# EAGLE design ATtiny841_StepperTesting (EAGLE 7.4.0)
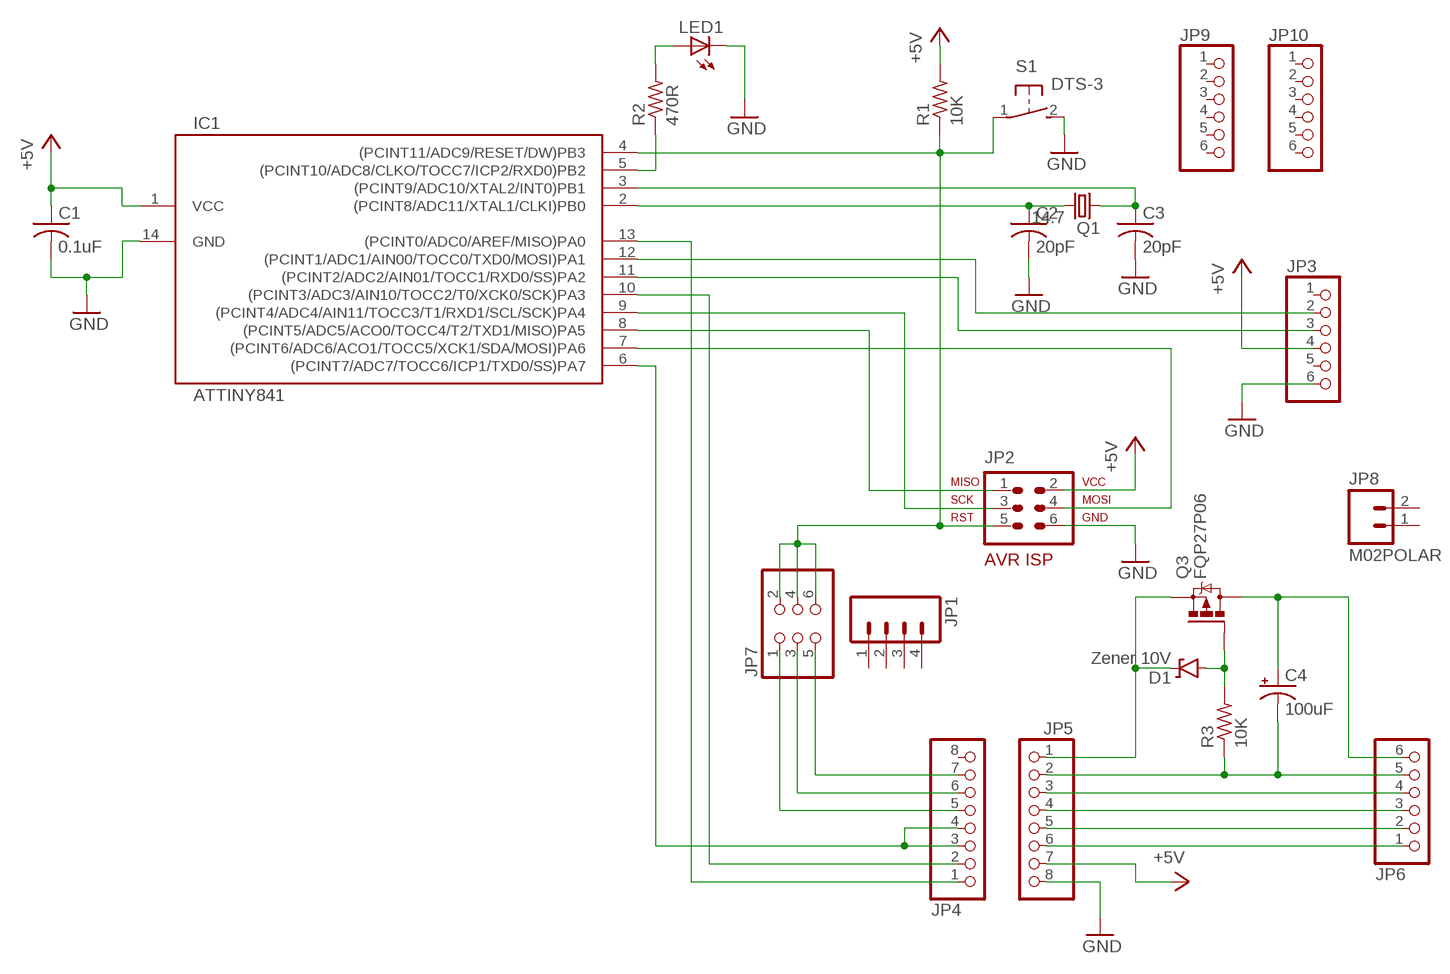
[diagram p0: schematic, sheet 1]

## Parts
C1  0.1uF  C025  [C025-024X044]
C2  20pF  C025  [C025-024X044]
C3  20pF  C025  [C025-024X044]
C4  100uF  CPOL-USE3.5-8  [E3,5-8]
D1  Zener 10V  DIODE-ZENERPTH  [DIODE-ZENER]
IC1  ATTINY841  ATTINY441/841-SSU  [SOIC14]
JP1  M04POLAR  [MOLEX-1X4]
JP2  AVR-ISP-6VERT  [AVR-ISP-6]
JP3  PINHD-1X6CB  [1X06-CLEANBIG]
JP4  PINHD-1X8CLEANBIG  [1X08-CLEANBIG]
JP5  PINHD-1X8CLEANBIG  [1X08-CLEANBIG]
JP6  PINHD-1X6CB  [1X06-CLEANBIG]
JP7  PINHD-2X3  [2X03]
JP8  M02POLAR  [MOLEX-1X2]
JP9  PINHD-1X6CB  [1X06-CLEANBIG]
JP10  PINHD-1X6CB  [1X06-CLEANBIG]
LED1  LED5MM  [LED5MM]
Q1  14.7  CRYSTALHC49S  [HC49/S]
Q3  FQP27P06  IRF9530  [TO220BV]
R1  10K  R-US_0207/7  [0207/7]
R2  470R  R-US_0207/7  [0207/7]
R3  10K  R-US_0207/7  [0207/7]
S1  DTS-3  [DTS-3]

## Nets
+5V: C1.1 IC1.1(VCC) JP2.2 JP3.4 JP5.7 R1.2
DIR: IC1.13((PCINT0/ADC0/AREF/MISO)PA0) JP4.1
GND: C1.2 C2.2 C3.2 IC1.14(GND) JP2.6 JP3.6 JP5.8 LED1.K(C) S1.2
MISO: IC1.8((PCINT5/ADC5/ACO0/TOCC4/T2/TXD1/MISO)PA5) JP2.1
MM-IN: C4.+ JP6.6 Q3.D
MOSI: IC1.7((PCINT6/ADC6/ACO1/TOCC5/XCK1/SDA/MOSI)PA6) JP2.4
MOT-RET: C4.- JP5.2 JP6.5 R3.1
MS1: JP4.7 JP7.5
MS2: JP4.6 JP7.3
MS3: JP4.5 JP7.1
N$9: JP5.3 JP6.4
N$11: LED1.A R2.2
N$12: JP5.4 JP6.3
N$13: JP5.5 JP6.2
N$14: JP5.6 JP6.1
N$17: D1.P$2(A) Q3.G R3.2
PB2: IC1.5((PCINT10/ADC8/CLKO/TOCC7/ICP2/RXD0)PB2) R2.1
RST: IC1.4((PCINT11/ADC9/RESET/DW)PB3) JP2.5 JP7.2 JP7.4 JP7.6 R1.1 S1.1
RXD0: IC1.11((PCINT2/ADC2/AIN01/TOCC1/RXD0/SS)PA2) JP3.3
SCK: IC1.9((PCINT4/ADC4/AIN11/TOCC3/T1/RXD1/SCL/SCK)PA4) JP2.3
SLEEP: IC1.6((PCINT7/ADC7/TOCC6/ICP1/TXD0/SS)PA7) JP4.3 JP4.4
STEP: IC1.10((PCINT3/ADC3/AIN10/TOCC2/T0/XCK0/SCK)PA3) JP4.2
TXD0: IC1.12((PCINT1/ADC1/AIN00/TOCC0/TXD0/MOSI)PA1) JP3.2
VMOT: D1.P$1(C) JP5.1 Q3.S
XTAL1: C3.1 IC1.3((PCINT9/ADC10/XTAL2/INT0)PB1) Q1.1
XTAL2: C2.1 IC1.2((PCINT8/ADC11/XTAL1/CLKI)PB0) Q1.2
Unconnected: JP1.1 JP1.2 JP1.3 JP1.4 JP3.1 JP3.5 JP4.8 JP8.1 JP8.2 JP9.1 JP9.2 JP9.3 JP9.4 JP9.5 JP9.6 JP10.1 JP10.2 JP10.3 JP10.4 JP10.5 JP10.6

## Library data of the parts
C1-C3 = au:C025
C4 = rcl:CPOL-US: POLARIZED CAPACITOR, American symbol
D1 = au:DIODE-ZENER: Zener Diode Production Part - 8199 3.4V Zener Voltage
IC1 = bog-thoughts_AVR:ATTINY441/841: ATtiny441, ATtiny841 AVR Microcontroller The high-performance Atmel picoPower 8-bit AVR RISC-based microcontroller combines 4KB ISP flash memory, 512-Byte EEPROM, 128B SRAM, 12 general purpose I/O lines, 32 general purpose working registers, an 8-bit timer/counter with two PWM channels, two 16-bit timer/counters with two PWM channels, internal and external interrupts, an 12-channel 10-bit A/D converter, 2 On-chip analog comparators, 2 full duplex USARTs with Start Frame wake up from power down, master/slave SPI serial interface, slave I2C serial interface, programmable gain stage (1x, 20x, and 100x) for 12 differential ADC channel pairs, programmable watchdog timer with internal oscillator, internal calibrated oscillator, and four software selectable power saving modes. The device operates between 1.7-5.5 volts. datasheet.pdf <http://www.atmel.com/Images/Atmel-8495-8-bit-AVR-Microcontrollers-ATtiny441-ATtiny841_Datasheet.pdf>
JP1 = SparkFun-Connectors:M04: Header 4 Standard 4-pin 0.1" header. Use with straight break away headers (SKU : PRT-00116), right angle break away headers (PRT-00553), swiss pins (PRT-00743), machine pins (PRT-00117), and female headers (PRT-00115). Molex polarized connector foot print use with SKU : PRT-08231 with associated crimp pins and housings. 1MM SMD Version SKU: PRT-10208
JP2 = avr-7:AVR-ISP-6: AVR ISP-6 Serial Programming Header
JP3 JP6 JP9 JP10 = adafruit:PINHD-1X6: PIN HEADER
JP4 JP5 = adafruit:PINHD-1X8: PIN HEADER
JP7 = SparkFun-Connectors:PINHD-2X3: PIN HEADER
JP8 = SparkFun-Connectors:M02: Standard 2-pin 0.1" header. Use with - straight break away headers ( PRT-00116) - right angle break away headers (PRT-00553) - swiss pins (PRT-00743) - machine pins (PRT-00117) - female headers (PRT-00115) Molex polarized connector foot print use with: PRT-08233 with associated crimp pins and housings. 2.54_SCREWTERM for use with PRT-10571. 3.5mm Screw Terminal footprints for PRT-08084 5mm Screw Terminal footprints for use with PRT-08432
LED1 = adafruit:LED: LED OSRAM: - CHIPLED LG R971, LG N971, LY N971, LG Q971, LY Q971, LO R971, LY R971 LH N974, LH R974 LS Q976, LO Q976, LY Q976 LO Q996 - Hyper CHIPLED LW Q18S LB Q993, LB Q99A, LB R99A - SideLED LS A670, LO A670, LY A670, LG A670, LP A670 LB A673, LV A673, LT A673, LW A673 LH A674 LY A675 LS A676, LA A676, LO A676, LY A676, LW A676 LS A679, LY A679, LG A679 - Hyper Micro SIDELED® LS Y876, LA Y876, LO Y876, LY Y876 LT Y87S - SmartLED LW L88C, LW L88S LB L89C, LB L89S, LG L890 LS L89K, LO L89K, LY L89K LS L896, LA L896, LO L896, LY L896 - TOPLED LS T670, LO T670, LY T670, LG T670, LP T670 LSG T670, LSP T670, LSY T670, LOP T670, LYG T670 LG T671, LOG T671, LSG T671 LB T673, LV T673, LT T673, LW T673 LH T674 LS T676, LA T676, LO T676, LY T676, LB T676, LH T676, LSB T676, LW T676 LB T67C, LV T67C, LT T67C, LS T67K, LO T67K, LY T67K, LW E67C LS E67B, LA E67B, LO E67B, LY E67B, LB E67C, LV E67C, LT E67C LW T67C LS T679, LY T679, LG T679 LS T770, LO T770, LY T770, LG T770, LP T770 LB T773, LV T773, LT T773, LW T773 LH T774 LS E675, LA E675, LY E675, LS T675 LS T776, LA T776, LO T776, LY T776, LB T776 LHGB T686 LT T68C, LB T68C - Hyper Mini TOPLED® LB M676 - Mini TOPLED Santana® LG M470 LS M47K, LO M47K, LY M47K Source: http://www.osram.convergy.de/
Q1 = crystal:CRYSTAL: CRYSTAL; OC_FARNELL: 1667008; OC_NEWARK: unknown
Q3 = transistor-power:IRF9530: P-CHANNEL HEXFET POWER-MOS-FET Source: http://www.irf.com/product-info/datasheets/data/irf9530.pdf
R1-R3 = adafruit:R-US_: RESISTOR, American symbol
S1 = au:DTS-3

## Board
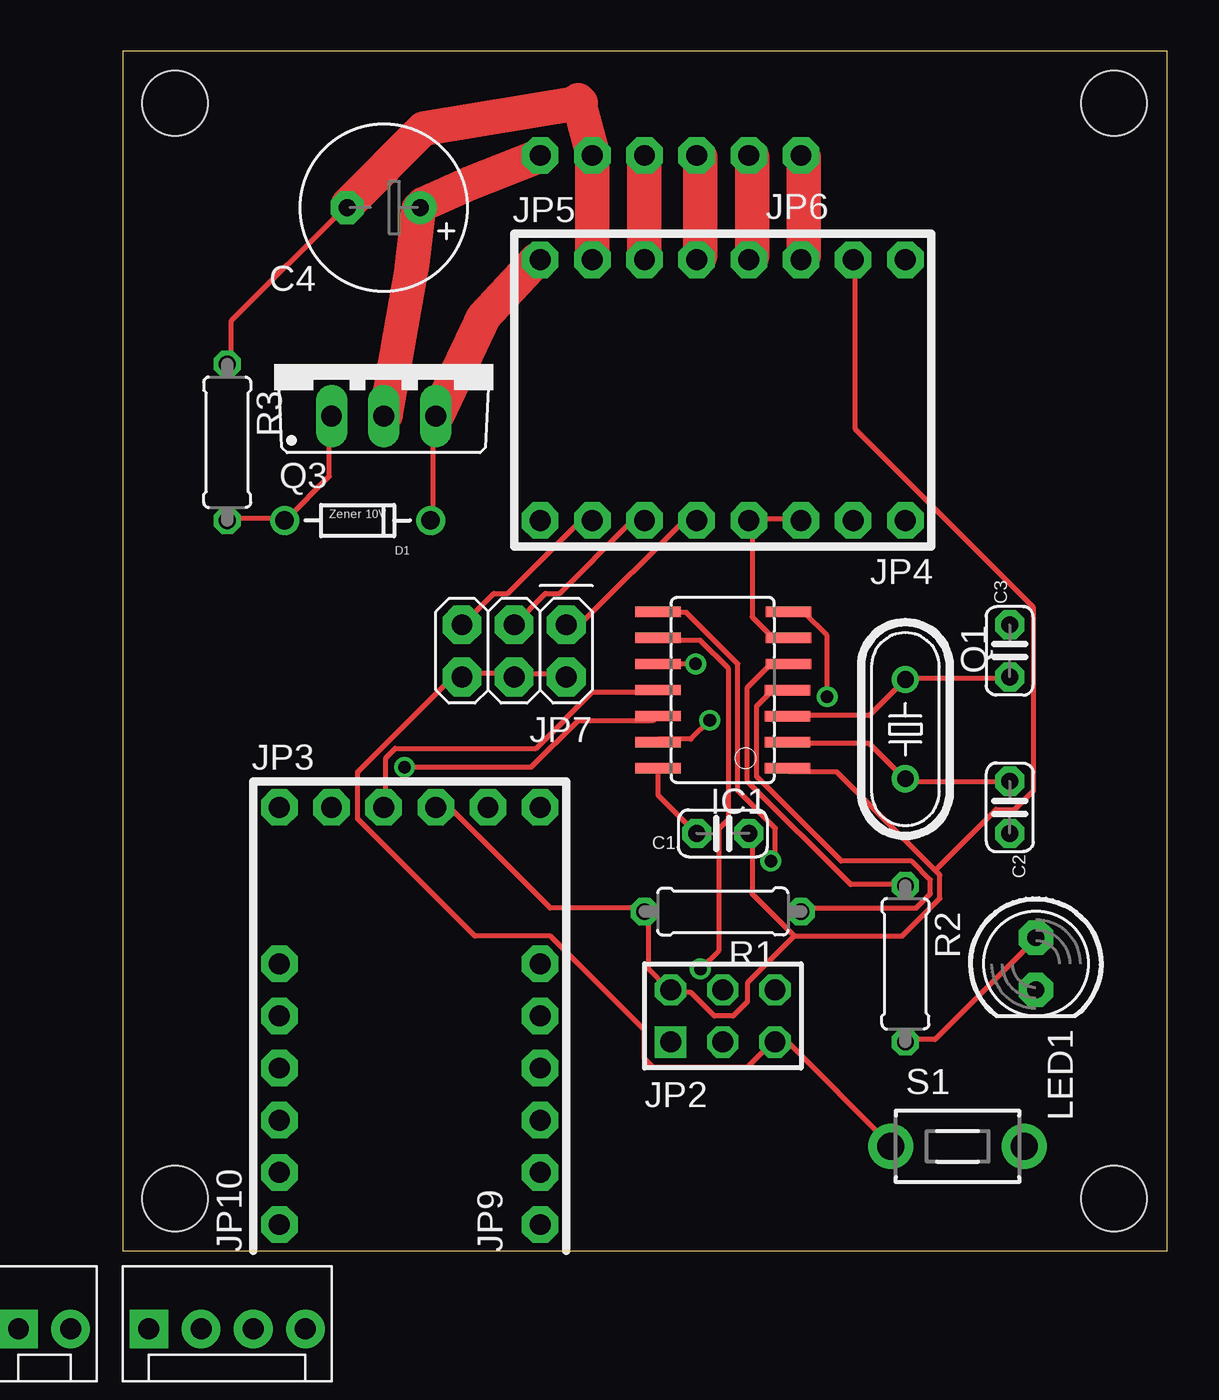
[diagram p1: board, top side]
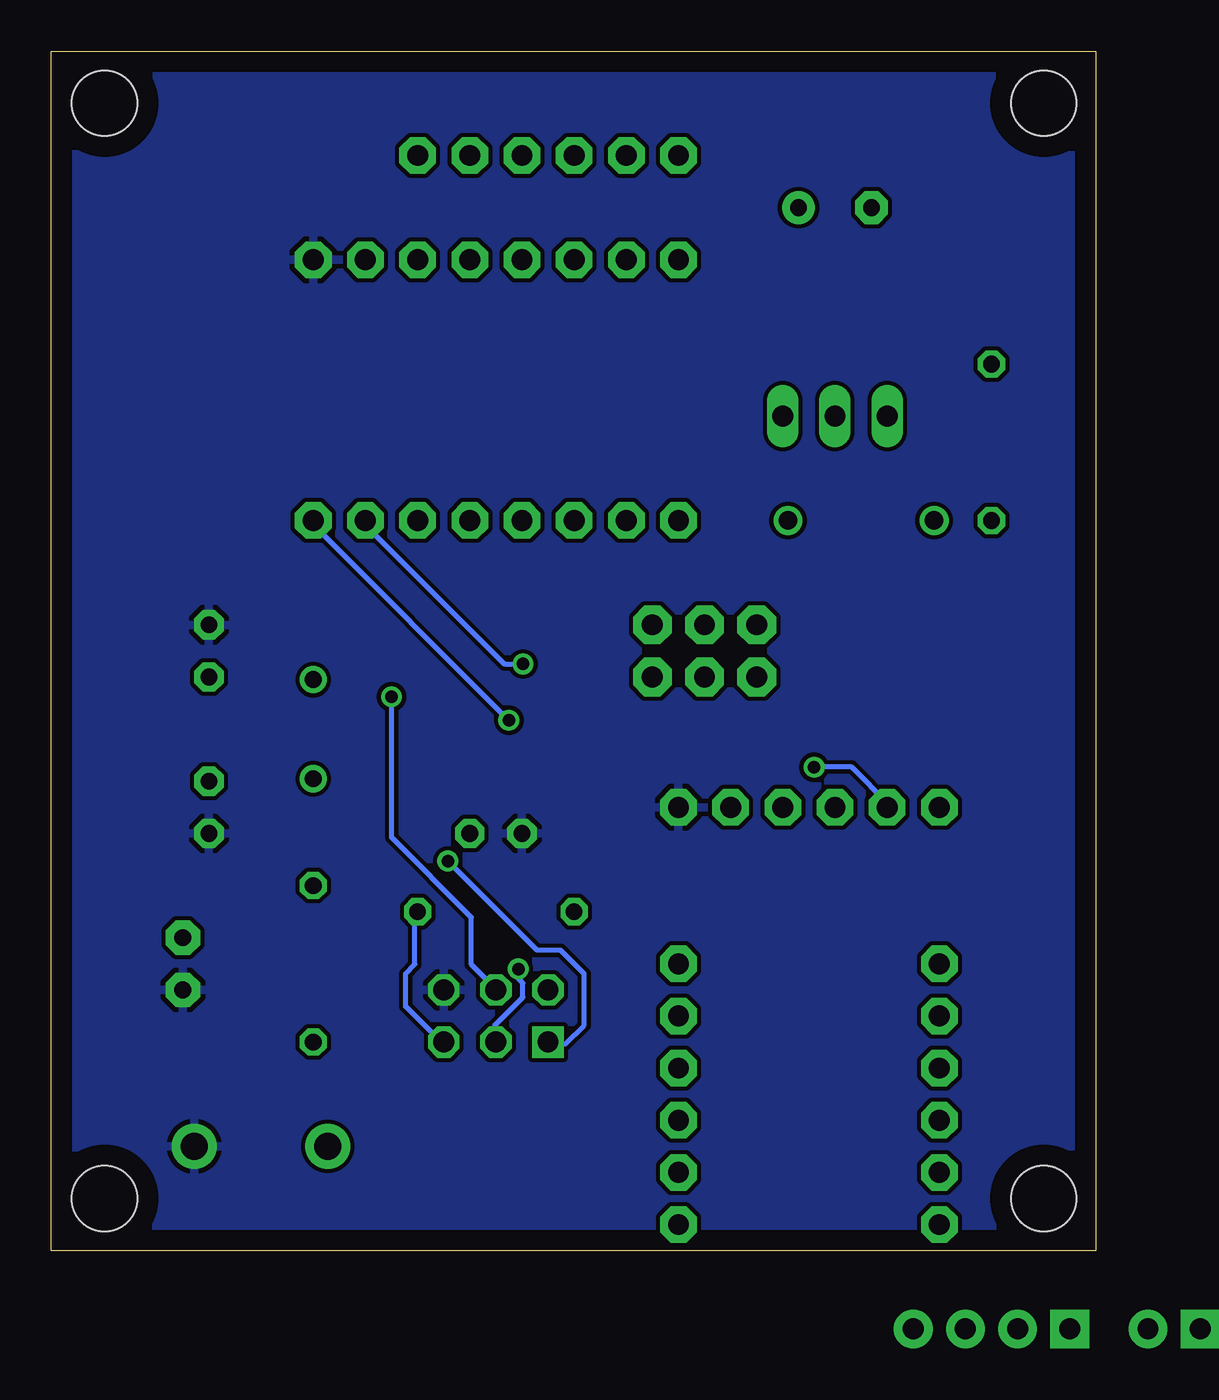
[diagram p2: board, bottom side, seen from below]

Size 50.85 x 58.41 mm. Coordinates in mm from the lower left corner, seen from the top.
Outline: 0,0 50.85,0 50.85,58.41 0,58.41 0,0
Copper layers (1*16): Top 0.035mm / dielectric 1.5mm / Bottom 0.035mm
Design rules "default *": minimum track width 10mil, minimum drill 24mil, track to track 8mil, track to pad 10mil, pad to pad 8mil, via to via 8mil, smd to smd 8mil, copper to edge 40mil, drill to drill 8mil, minimum pad ring 10mil, minimum via ring 8mil, stop-mask expansion 4mil, vias tented up to drill 0mil, thermal gap 10mil
Holes 3.17 mm at 2.54,2.54 2.54,55.88 48.26,2.54 48.26,55.88

### Footprints (pad centres in the part's own frame; a part is rotated, then mirrored left to right if it is on the bottom)
C025-024X044 = drill 0.813 pad 1.422 octagon: 1 -1.27,0; 2 1.27,0
E3,5-8 = drill 0.813 pad 1.6: + -1.778,0 | drill 0.813 pad 1.6 octagon: - 1.778,0
DIODE-ZENER = drill 0.9: P$1 -3.556,0; P$2 3.556,0
SOIC14 = smd 0.5 x 2.2: 1 -1.905,-3.154; 2 -0.645,-3.154; 3 0.625,-3.154; 4 1.895,-3.154; 5 3.175,-3.196; 6 4.445,-3.196; 7 5.715,-3.196; 8 5.715,3.154; 9 4.445,3.154; 10 3.175,3.154; 11 1.905,3.154; 12 0.635,3.154; 13 -0.635,3.154; 14 -1.905,3.154
MOLEX-1X4 = drill 1.016 pad 1.88 square: 1 0,0 | drill 1.016 pad 1.88: 2 2.54,0; 3 5.08,0; 4 7.62,0
AVR-ISP-6 = drill 1.016 square: 1 -2.54,-1.27 | drill 1.016 octagon: 2 -2.54,1.27; 3 0,-1.27; 4 0,1.27; 5 2.54,-1.27; 6 2.54,1.27
1X06-CLEANBIG = drill 1.016 pad 1.778 octagon: 1 -6.35,0; 2 -3.81,0; 3 -1.27,0; 4 1.27,0; 5 3.81,0; 6 6.35,0
1X08-CLEANBIG = drill 1.016 pad 1.778 octagon: 1 -8.89,0; 2 -6.35,0; 3 -3.81,0; 4 -1.27,0; 5 1.27,0; 6 3.81,0; 7 6.35,0; 8 8.89,0
2X03 = drill 1.016 pad 1.88 octagon: 1 -2.54,-1.27; 2 -2.54,1.27; 3 0,-1.27; 4 0,1.27; 5 2.54,-1.27; 6 2.54,1.27
MOLEX-1X2 = drill 1.016 pad 1.88 square: 1 0,0 | drill 1.016 pad 1.88: 2 2.54,0
LED5MM = drill 0.813 pad 1.676 octagon: A -1.27,0; K 1.27,0
HC49/S = drill 0.813: 1 -2.413,0; 2 2.413,0
TO220BV = drill 1.016 long: D 0,-2.54; G -2.54,-2.54; S 2.54,-2.54
0207/7 = drill 0.813 octagon: 1 -3.81,0; 2 3.81,0
DTS-3 = drill 1.3 pad 2.184: 1 -3.25,0; 2 3.25,0

### Placement (x,y rotation side)
C1  29.21,20.32 180 top
C2  43.18,21.59 270 top
C3  43.18,29.21 90 top
C4  12.7,50.8 180 top
D1  11.43,35.56 180 top
IC1  29.21,25.4 90 top
JP1  1.27,-3.81 0 top  (outside the outline)
JP2  29.21,11.43 0 top
JP3  13.97,21.59 0 top
JP4  29.21,35.56 180 top
JP5  29.21,48.26 0 top
JP6  26.67,53.34 180 top
JP7  19.05,29.21 180 top
JP8  -5.08,-3.81 0 top  (outside the outline)
JP9  20.32,7.62 90 top
JP10  7.62,7.62 90 top
LED1  44.45,13.97 270 top
Q1  38.1,25.4 270 top
Q3  12.7,43.18 0 top
R1  29.21,16.51 180 top
R2  38.1,13.97 270 top
R3  5.08,39.37 270 top
S1  40.64,5.08 0 top

### Tracks (layer width: path | path; a pad name or v marks a point on that pad's centre or on a via)
+5V
  Top 0.254: JP3.4 15.32,21.49 16,21.49 20.8,16.69 25.38,16.69 R1.2 25.6,16.46 25.6,13.72 26.52,12.8 JP2.2 26.75,12.57 27.66,12.57 28.8,11.43 29.72,11.43 30.4,12.12 30.4,13.03 32.69,15.32 | 39.55,18.52 39.78,18.29 39.78,17.14 37.95,15.32 32.69,15.32 | 39.55,18.52 34.75,23.32 32.46,23.32 IC1.1 | 32.69,15.32 30.63,17.37 30.63,20.12 C1.1 | 39.55,18.52 42.52,21.49 43.43,21.49 44.35,22.4 44.35,31.32 35.66,40.01 35.66,48.23 JP5.7
DIR  (via drill 0.61)
  Top 0.254: v28.57,25.83 27.66,24.92 26.06,24.92 IC1.13
  Bottom 0.254: v28.57,25.83 38.18,35.43 JP4.1
GND
  Top 0.254: IC1.14 26.06,23.32 26.06,22.17 27.89,20.34 C1.2
  pour Bottom: 0,0 50.8,0 50.8,58.42 0,58.42
MISO  (via drill 0.61)
  Top 0.254: v31.55,18.97 31.77,19.2 31.77,20.57 29.95,22.4 29.95,28.57 27.43,31.09 26.06,31.09 IC1.8
  Bottom 0.254: v31.55,18.97 27.2,14.63 26.06,14.63 24.92,13.49 24.92,10.97 25.83,10.06 26.52,10.06 JP2.1
MM-IN
  Top 0.254: 12.8,40.69 Q3.D | 14.4,50.75 C4.+ 14.63,50.98 | 20.12,53.26 JP6.6
  Top 1.676: 12.8,40.69 14.07,47.88 14.4,50.75 | 20.12,53.26 16.92,51.99 14.63,50.98
MOSI  (via drill 0.61)
  Top 0.254: v34.29,26.98 34.29,29.95 33.15,31.09 32.46,31.09 IC1.7
  Bottom 0.254: v34.29,26.98 34.29,20.12 30.4,16.23 30.4,13.95 29.26,12.8 JP2.4
MOT-RET
  Top 0.254: R3.1 5.26,43.2 5.26,45.26 10.74,50.75 C4.- 10.97,50.98 | 22.3,55.91 22.17,56.03 | 22.86,53.49 JP6.5
  Top 1.676: JP6.5 JP5.2 | 22.17,56.03 22.86,53.49 | 22.3,55.91 14.63,54.63 10.97,50.98
MS1
  Top 0.254: JP4.7 22.86,35.43 22.17,35.43 18.75,32 18.06,32 16.69,30.63 JP7.5
MS2
  Top 0.254: JP7.3 20.57,32 21.26,32 24.69,35.43 25.38,35.43 JP4.6
MS3
  Top 0.254: JP4.5 27.89,35.43 27.2,35.43 22.4,30.63 21.72,30.63 JP7.1
N$9
  Top 0.254: 25.38,48.46 JP5.3 | 25.38,53.26 JP6.4
  Top 1.676: 25.38,53.26 25.38,48.46
N$11
  Top 0.254: R2.2 38.18,10.29 39.55,10.29 44.35,15.09 LED1.A
N$12
  Top 0.254: 28.12,48.46 JP5.4 | 28.12,53.26 JP6.3
  Top 1.676: 28.12,53.26 28.12,48.46
N$13
  Top 0.254: 30.63,48.46 JP5.5 | 30.63,53.26 JP6.2
  Top 1.676: 30.63,53.26 30.63,48.46
N$14
  Top 0.254: 33.15,48.46 JP5.6 | 33.15,53.26 JP6.1
  Top 1.676: 33.15,53.26 33.15,48.46
N$17
  Top 0.254: R3.2 5.26,35.66 7.77,35.66 D1.P$2 8,35.66 10.06,37.72 10.06,40.46 Q3.G
PB2
  Top 0.254: IC1.5 31.55,28.57 30.4,27.43 30.4,22.86 35.43,17.83 37.95,17.83 R2.1
RST
  Top 0.254: IC1.4 32.23,27.2 31.55,27.2 30.86,26.52 30.86,23.09 34.98,18.97 38.41,18.97 39.32,18.06 39.32,17.37 38.63,16.69 33.15,16.69 R1.1 | JP7.2 21.49,28.12 19.2,28.12 JP7.4 18.97,28.12 16.69,28.12 JP7.6 16.46,27.89 16,27.89 11.43,23.32 11.43,21.03 17.14,15.32 20.8,15.32 25.38,10.74 25.38,9.37 25.83,8.91 30.4,8.91 31.55,10.06 JP2.5 31.77,10.06 32.46,10.06 37.26,5.26 S1.1
  Bottom 0.254: R1.1 33.15,16.46 33.15,13.95 33.6,13.49 33.6,11.89 31.77,10.06 JP2.5
RXD0
  Top 0.254: IC1.11 25.83,27.2 22.86,27.2 20.12,24.46 13.26,24.46 12.8,24 12.8,21.72 JP3.3
SCK  (via drill 0.61)
  Top 0.254: v28.12,13.72 29.03,14.63 29.03,20.57 29.49,21.03 29.49,28.35 28.12,29.72 26.06,29.72 IC1.9
  Bottom 0.254: v28.12,13.72 28.12,13.26 27.89,13.03 27.89,12.34 29.26,10.97 29.26,10.29 JP2.3
SLEEP
  Top 0.254: IC1.6 32.23,29.95 31.55,29.95 30.63,30.86 30.63,35.43 JP4.4 30.63,35.66 32.92,35.66 JP4.3
STEP  (via drill 0.61)
  Top 0.254: v27.89,28.57 IC1.10
  Bottom 0.254: v27.89,28.57 28.8,28.57 35.66,35.43 JP4.2
TXD0  (via drill 0.61)
  Top 0.254: v13.72,23.55 19.89,23.55 22.17,25.83 25.83,25.83 IC1.12
  Bottom 0.254: v13.72,23.55 11.89,23.55 10.06,21.72 JP3.2
VMOT
  Top 0.254: D1.P$1 15.09,35.66 15.09,40.46 Q3.S 15.32,40.69 | 20.12,48.23 JP5.1
  Top 1.676: 20.12,48.23 17.58,45.49 15.32,40.69
XTAL1
  Top 0.254: IC1.3 32.46,26.06 36.35,26.06 Q1.1 38.18,27.89 42.98,27.89 C3.1
XTAL2
  Top 0.254: IC1.2 32.46,24.69 36.35,24.69 37.95,23.09 Q1.2 38.18,22.86 C2.1